# EAGLE design motor_controller (EAGLE 9.6.0)
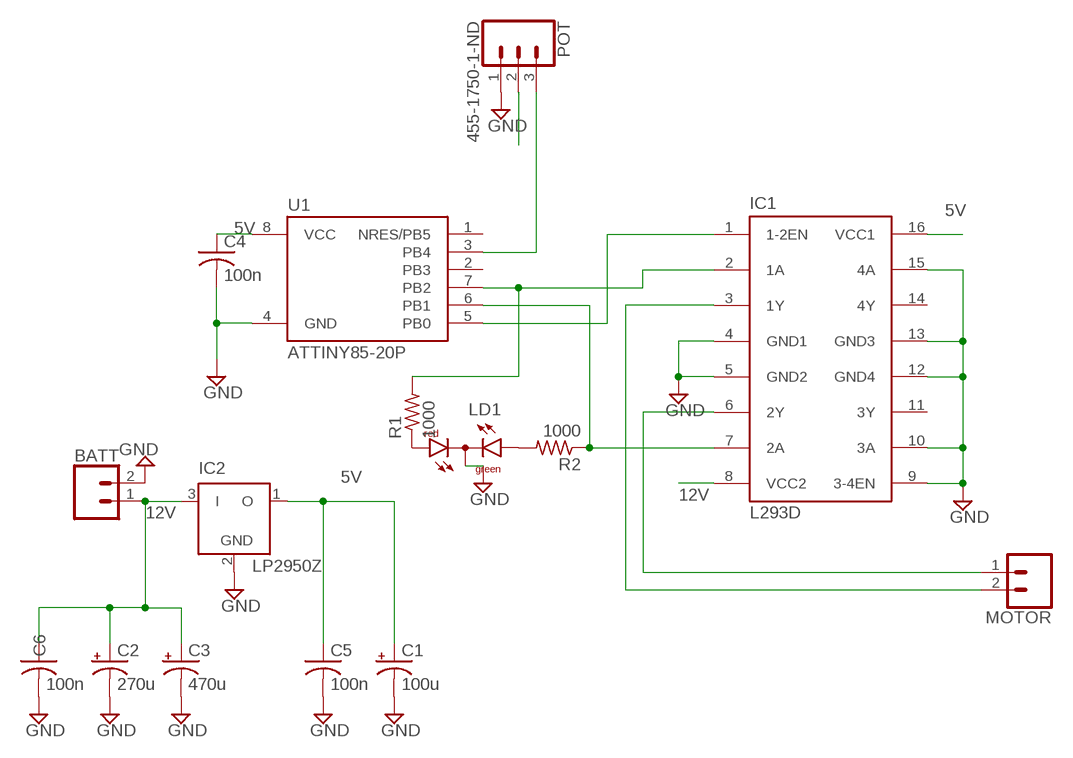
[diagram p0: schematic, sheet 1]

## Parts
BATT  CONN_02  [1X02]
C1  100u  CPOL-USE3.5-10  [E3,5-10]
C2  270u  CPOL-USE3.5-10  [E3,5-10]
C3  470u  CPOL-USE3.5-10  [E3,5-10]
C4  100n  C-US050-055X075  [C050-055X075]
C5  100n  C-US050-055X075  [C050-055X075]
C6  100n  C-US050-055X075  [C050-055X075]
IC1  L293D  [DIL16]
IC2  LP2950Z  [TO92]
LD1  DUOLED-RG-C  [DUOLED-C-5MM]
MOTOR  CONN_02  [1X02]
POT  455-1750-1-ND  CONN_03  [1X03]
R1  1000  R-US_0204/7  [0204/7]
R2  1000  R-US_0204/7  [0204/7]
U1  ATTINY85-20P  [PDIP08_300MIL]

## Nets
5V: C1.+ C4.1 C5.1 IC1.16(VCC1) IC2.1(O) POT.2 U1.8(VCC)
12V: BATT.1 C2.+ C3.+ C6.1 IC1.8(VCC2) IC2.3(I)
GND: BATT.2 C1.- C2.- C3.- C4.2 C5.2 C6.2 IC1.4(GND1) IC1.5(GND2) IC1.9(3-4EN) IC1.10(3A) IC1.12(GND4) IC1.13(GND3) IC1.15(4A) IC2.2(GND) LD1.C POT.1 U1.4(GND)
N$1: IC1.1(1-2EN) U1.5(PB0)
N$2: IC1.6(2Y) MOTOR.1
N$3: IC1.3(1Y) MOTOR.2
N$4: IC1.7(2A) R2.1 U1.6(PB1)
N$5: IC1.2(1A) R1.2 U1.7(PB2)
N$6: LD1.AR R1.1
N$7: LD1.AX(AG) R2.2
N$8: POT.3 U1.3(PB4)
Unconnected: IC1.11(3Y) IC1.14(4Y) U1.1(NRES/PB5) U1.2(PB3)

## Library data of the parts
BATT MOTOR = SparkFun-Connectors:CONN_02: Multi connection point. Often used as Generic Header-pin footprint for 0.1 inch spaced/style header connections On any of the 0.1 inch spaced packages, you can populate with these: Break Away Headers - Straight <https://www.sparkfun.com/products/116> (PRT-00116) Break Away Male Headers - Right Angle <https://www.sparkfun.com/products/553> (PRT-00553) Female Headers <https://www.sparkfun.com/products/115> (PRT-00115) Break Away Headers - Machine Pin <https://www.sparkfun.com/products/117> (PRT-00117) Break Away Female Headers - Swiss Machine Pin <https://www.sparkfun.com/products/743> (PRT-00743) For SCREWTERMINALS and SPRING TERMINALS visit here: Screw Terimnals on SparkFun.com <https://www.sparkfun.com/search/results?term=Screw+Terminals> (5mm/3.5mm/2.54mm spacing) This device is also useful as a general connection point to wire up your design to another part of your project. Our various solder wires solder well into these plated through hole pads. Hook-Up Wire - Assortment (Stranded, 22 AWG) <https://www.sparkfun.com/products/11375> (PRT-11375) Hook-Up Wire - Assortment (Solid Core, 22 AWG) <https://www.sparkfun.com/products/11367> (PRT-11367) View the entire wire category on our website here <https://www.sparkfun.com/categories/141> Special notes: Molex polarized connector foot print use with: PRT-08233 with associated crimp pins and housings. 2.54_SCREWTERM for use with PRT-10571. 3.5mm Screw Terminal footprints for PRT-08084 5mm Screw Terminal footprints for use with PRT-08432
C1-C3 = adafruit:CPOL-US: POLARIZED CAPACITOR, American symbol
C4-C6 = adafruit:C-US: CAPACITOR, American symbol
IC1 = st-microelectronics:L293D: PUSH-PULL 4 CHANNEL DRIVER; MPN: L293D; OC_FARNELL: 9589619; OC_NEWARK: 56P8249
IC2 = linear:LP2950: 100 mA, Low Power Low Dropout Voltage Regulator Source: http://www.onsemi.com/pub/Collateral/LP2950-D.PDF
LD1 = led:DUOLED-RG-C: DUO LED 2 colors (red/green), 5 mm, round, common Cathode www.ligitek.com or other producers.
POT = SparkFun-Connectors:CONN_03: Multi connection point. Often used as Generic Header-pin footprint for 0.1 inch spaced/style header connections On any of the 0.1 inch spaced packages, you can populate with these: Break Away Headers - Straight <https://www.sparkfun.com/products/116> (PRT-00116) Break Away Male Headers - Right Angle <https://www.sparkfun.com/products/553> (PRT-00553) Female Headers <https://www.sparkfun.com/products/115> (PRT-00115) Break Away Headers - Machine Pin <https://www.sparkfun.com/products/117> (PRT-00117) Break Away Female Headers - Swiss Machine Pin <https://www.sparkfun.com/products/743> (PRT-00743) Stackable Header - 3 Pin (Female, 0.1") <https://www.sparkfun.com/products/13875> (PRT-13875) For SCREWTERMINALS and SPRING TERMINALS visit here: Screw Terimnals on SparkFun.com <https://www.sparkfun.com/search/results?term=Screw+Terminals> (5mm/3.5mm/2.54mm spacing) This device is also useful as a general connection point to wire up your design to another part of your project. Our various solder wires solder well into these plated through hole pads. Hook-Up Wire - Assortment (Stranded, 22 AWG) <https://www.sparkfun.com/products/11375> (PRT-11375) Hook-Up Wire - Assortment (Solid Core, 22 AWG) <https://www.sparkfun.com/products/11367> (PRT-11367) View the entire wire category on our website here <https://www.sparkfun.com/categories/141> Special notes: Molex polarized connector foot print use with SKU : PRT-08232 with associated crimp pins and housings.; PROD_ID: XXX-00000
R1 R2 = adafruit:R-US_: RESISTOR, American symbol
U1 = _hhn_attiny25_45_85:ATTINY85*: ATMEL ATtiny 85 Packages: P = PDIP 08 30mil S = SOIC 08 EIAJ 208mil Technologies Note: for complete ordering code (temp. range, finish, tape&reel etc.) see www.atmel.com • Supply Voltage: V = (1.8…5.5)V | [blank] = (2.7…5.5)V • Speed: 10 = 10 MHz | 20 = 20 MHz Author: Dipl.-Ing. FH Rainer Bayer HHN Hochschule Heilbronn (Heilbronn University), rainer.bayer@hs-heilbronn.de Ingenieurbüro ing-rb, mail@ing-rb.de

## Board
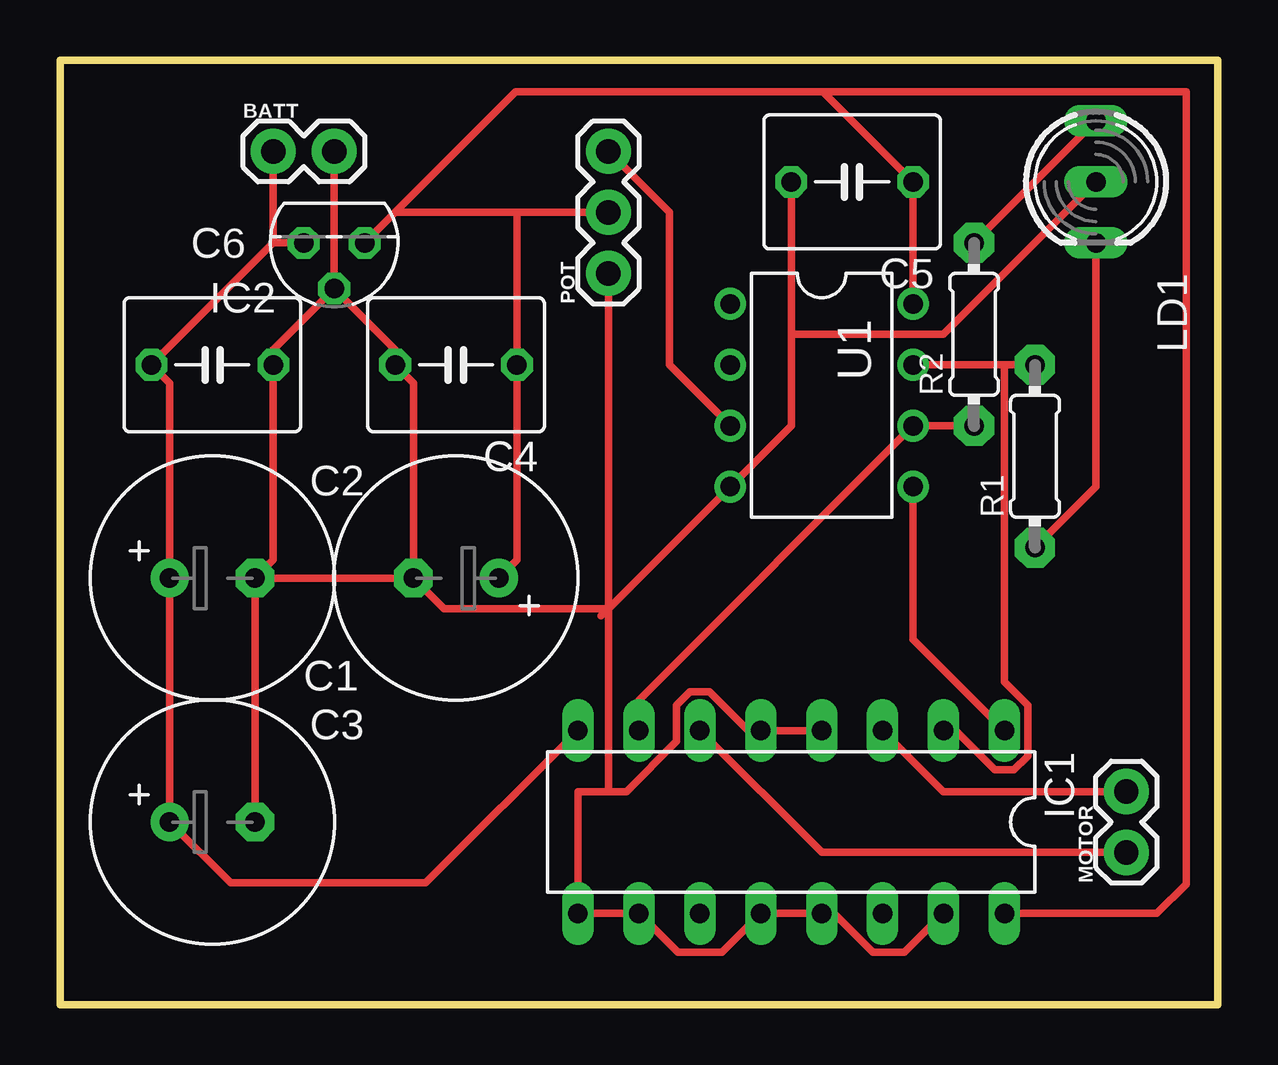
[diagram p1: board, top side]

Size 48.26 x 39.37 mm. Coordinates in mm from the lower left corner, seen from the top.
Outline: 0,0 0,39.37 48.26,39.37 48.26,0 0,0
Copper layers (1*16): Top 0.035mm / dielectric 1.5mm / Bottom 0.035mm
Design rules "default": minimum track width 6mil, minimum drill 0.35mm, track to track 6mil, track to pad 6mil, pad to pad 6mil, via to via 6mil, smd to smd 6mil, copper to edge 40mil, drill to drill 6mil, minimum pad ring 10mil, minimum via ring 8mil, stop-mask expansion 4mil, vias tented up to drill 0mil, thermal gap 10mil

### Footprints (pad centres in the part's own frame; a part is rotated, then mirrored left to right if it is on the bottom)
1X02 = drill 1.016 pad 1.88: 1 0,0; 2 2.54,0
E3,5-10 = drill 0.813 pad 1.6: + -1.778,0 | drill 0.813 pad 1.6 octagon: - 1.778,0
C050-055X075 = drill 0.813 octagon: 1 -2.54,0; 2 2.54,0
DIL16 = drill 0.813 long: 1 -8.89,-3.81; 2 -6.35,-3.81; 3 -3.81,-3.81; 4 -1.27,-3.81; 5 1.27,-3.81; 6 3.81,-3.81; 7 6.35,-3.81; 8 8.89,-3.81; 9 8.89,3.81; 10 6.35,3.81; 11 3.81,3.81; 12 1.27,3.81; 13 -1.27,3.81; 14 -3.81,3.81; 15 -6.35,3.81; 16 -8.89,3.81
TO92 = drill 0.813 octagon: 1 -1.27,0; 2 0,1.905; 3 1.27,0
DUOLED-C-5MM = drill 0.813 long: AR 2.54,0; AX -2.54,0; C 0,0
1X03 = drill 1.016 pad 1.88: 1 0,0; 2 2.54,0; 3 5.08,0
0204/7 = drill 0.813 pad 1.676 octagon: 1 -3.81,0; 2 3.81,0
PDIP08_300MIL = drill 0.813: 1 -3.81,-3.81; 2 -1.27,-3.81; 3 1.27,-3.81; 4 3.81,-3.81; 5 3.81,3.81; 6 1.27,3.81; 7 -1.27,3.81; 8 -3.81,3.81

### Placement (x,y rotation side)
BATT  8.89,35.56 0 top
C1  16.51,17.78 180 top
C2  6.35,17.78 0 top
C3  6.35,7.62 0 top
C4  16.51,26.67 180 top
C5  33.02,34.29 180 top
C6  6.35,26.67 0 top
IC1  30.48,7.62 180 top
IC2  11.43,31.75 180 top
LD1  43.18,34.29 270 top
MOTOR  44.45,6.35 90 top
POT  22.86,30.48 90 top
R1  40.64,22.86 90 top
R2  38.1,27.94 90 top
U1  31.75,25.4 270 top

### Tracks (layer width: path | path; a pad name or v marks a point on that pad's centre or on a via)
5V
  Top 0.305: C1.+ 19.05,18.54 C4.1 19.05,33.02 | U1.8 C5.1 31.8,38.05 | 31.8,38.05 19,38.05 IC2.1 13.97,33.02 19.05,33.02 | IC1.16 45.72,3.81 46.94,5.03 46.94,38.05 31.8,38.05 | 19.05,33.02 POT.2
12V
  Top 0.305: BATT.1 8.89,31.75 | 8.89,31.75 C6.1 4.57,25.91 C2.+ C3.+ 7.11,5.08 15.24,5.08 IC1.8 | 8.89,31.75 IC2.3
GND
  Top 0.305: C2.- 8.89,18.54 C6.2 8.89,27.3 IC2.2 | C2.- C3.- | C2.- C1.- | IC2.2 13.97,27.3 C4.2 14.73,25.91 C1.- | BATT.2 IC2.2 | C1.- 16,16.51 22.86,16.51 | 22.86,16.51 U1.4 30.48,24.13 30.48,27.94 | POT.1 22.86,16.51 | 30.48,27.94 C5.2 | IC1.15 35.2,2.18 33.89,2.18 32.27,3.81 IC1.13 IC1.12 27.58,2.18 25.76,2.18 IC1.10 IC1.9 21.59,8.89 22.86,8.89 | IC1.4 IC1.5 28.7,11.43 27.07,13.06 26.27,13.06 25.7,12.49 25.7,10.98 23.61,8.89 22.86,8.89 | 22.55,16.2 22.86,16.51 | 22.86,16.51 22.86,8.89 | LD1.C 36.83,27.94 30.48,27.94
N$1
  Top 0.305: IC1.1 35.56,15.24 U1.5
N$2
  Top 0.305: IC1.6 31.75,6.35 MOTOR.1
N$3
  Top 0.305: IC1.3 36.83,8.89 MOTOR.2
N$4
  Top 0.305: IC1.7 24.13,12.7 U1.6 R2.1
N$5
  Top 0.305: U1.7 39.37,26.67 | 39.37,26.67 R1.2 | IC1.2 37.34,11.43 38.97,9.8 39.77,9.8 40.34,10.37 40.34,12.49 39.37,13.46 39.37,26.67
N$6
  Top 0.305: R1.1 43.18,21.59 LD1.AR
N$7
  Top 0.305: R2.2 LD1.AX
N$8
  Top 0.305: U1.3 25.4,26.67 25.4,33.02 POT.3